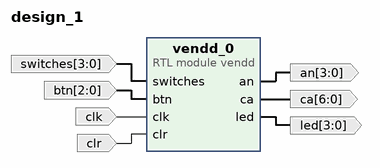
[diagram p0: block diagram of the top level]
# Vivado block design design_1, xc7a35ticpg236-1L, Vivado 2019.2
create_bd_design design_1

create_bd_port -dir I -from 3 -to 0 switches
create_bd_port -dir I -from 2 -to 0 btn
create_bd_port -dir I -type clk clk
set_property -dict {CONFIG.FREQ_HZ 100000000} [get_bd_ports clk]
create_bd_port -dir I clr
create_bd_port -dir O -from 3 -to 0 led
create_bd_port -dir O -from 3 -to 0 an
create_bd_port -dir O -from 6 -to 0 ca

create_bd_cell -type module -reference vendd vendd_0

# ---- connections ----

connect_bd_net [get_bd_ports switches] [get_bd_pins vendd_0/switches]
connect_bd_net [get_bd_ports btn] [get_bd_pins vendd_0/btn]
connect_bd_net [get_bd_ports clk] [get_bd_pins vendd_0/clk]
connect_bd_net [get_bd_ports clr] [get_bd_pins vendd_0/clr]
connect_bd_net [get_bd_pins vendd_0/led] [get_bd_ports led]
connect_bd_net [get_bd_pins vendd_0/an] [get_bd_ports an]
connect_bd_net [get_bd_pins vendd_0/ca] [get_bd_ports ca]

validate_bd_design
save_bd_design
